# Altium schematic sheet mgmt.SchDoc
size A
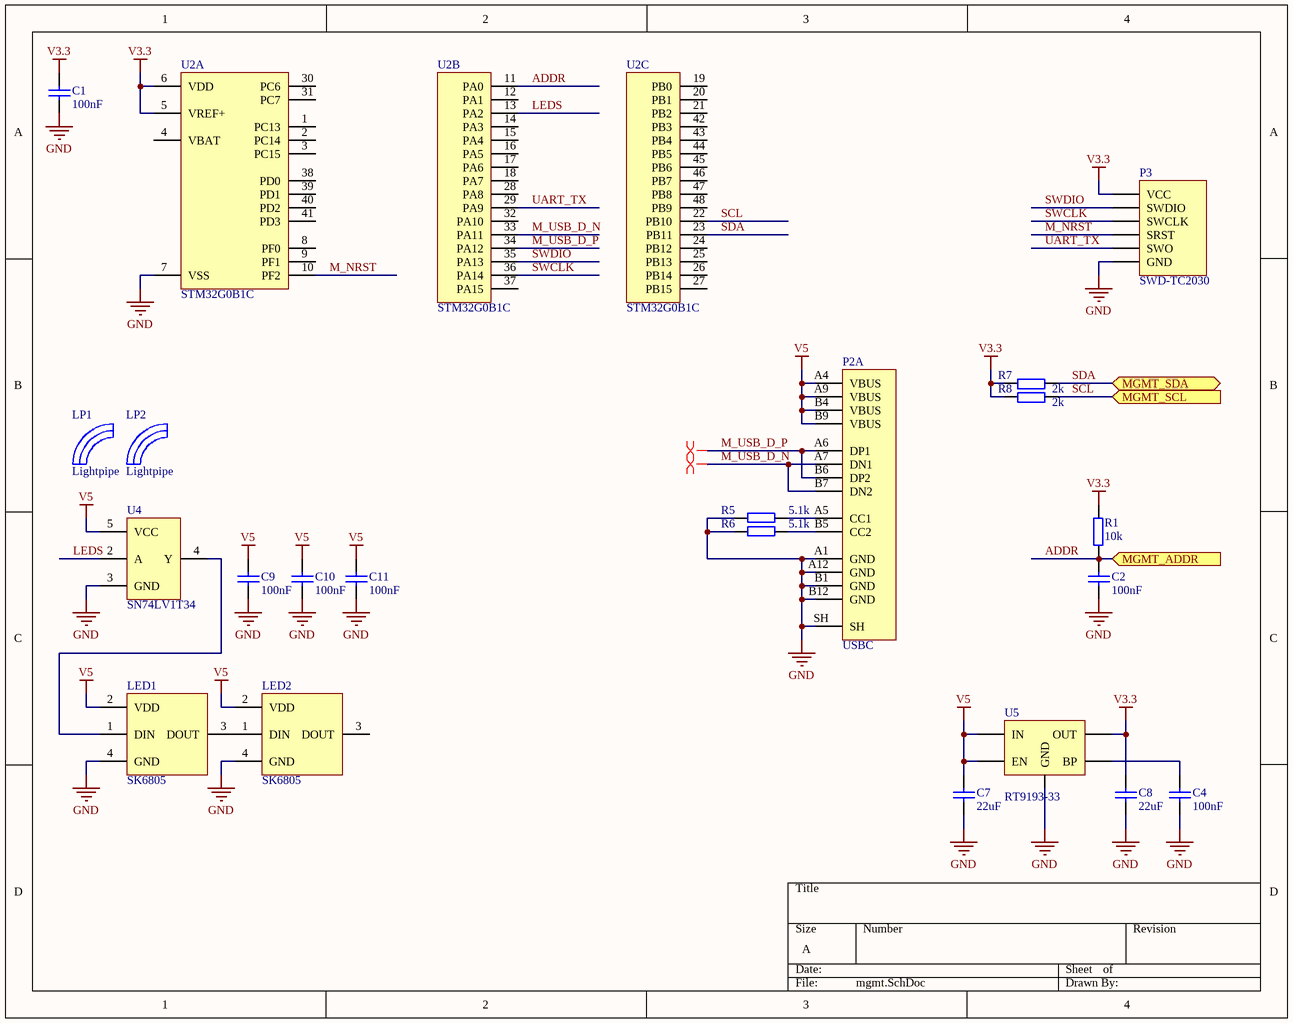
[diagram p0: mgmt.SchDoc]

## Parts
C1  100nF  [0402]
C2  100nF  [0402]
C4  100nF  [0402]
C7  22uF  [0805]
C8  22uF  [0805]
C9  100nF  [0402]
C10  100nF  [0402]
C11  100nF  [0402]
LED1  SK6805  [EC15]
LED2  SK6805  [EC15]
LP1  Lightpipe  [SLP3-150-100-F]
LP2  Lightpipe  [SLP3-150-100-F]
P2  USBC  [U262-161N-4BVC11]  (part A of 2)
P3  SWD-TC2030  [TC2030-NL]
R1  10k  [0402]
R5  5.1k  [0402]
R6  5.1k  [0402]
R7  2k  [0402]
R8  2k  [0402]
U2  STM32G0B1C  [QFP48]  (parts A,B,C of 3)
U4  SN74LV1T34  [SOT23-5]
U5  RT9193-33  [SOT23-5]

## Ports
MGMT_ADDR (in), MGMT_SCL (in), MGMT_SDA (bidir)

## Nets
GND: C1.1 C2.1 C4.1 C7.1 C8.1 C9.1 C10.1 C11.1 LED1.4(GND) LED2.4(GND) P2.A1(GND) P2.A12(GND) P2.B1(GND) P2.B12(GND) P2.SH P3.GND R5.1 R6.1 U2.7(VSS) U4.3(GND) U5.GND
V3.3: C1.2 C8.2 P3.VCC R1.2 R7.2 R8.2 U2.5(VREF+) U2.6(VDD) U5.OUT
V5: C7.2 C9.2 C10.2 C11.2 LED1.2(VDD) LED2.2(VDD) P2.A4(VBUS) P2.A9(VBUS) P2.B4(VBUS) P2.B9(VBUS) U4.5(VCC) U5.EN U5.IN
ADDR: C2.2 R1.1 U2.11(PA0) ; port MGMT_ADDR
LEDS: U2.13(PA2) U4.2(A)
M_NRST: P3.SRST U2.10(PF2)
M_USB_D_N: P2.A7(DN1) P2.B7(DN2) U2.33(PA11)
M_USB_D_P: P2.A6(DP1) P2.B6(DP2) U2.34(PA12)
SCL: R8.1 U2.22(PB10) ; port MGMT_SCL
SDA: R7.1 U2.23(PB11) ; port MGMT_SDA
SWCLK: P3.SWCLK U2.36(PA14)
SWDIO: P3.SWDIO U2.35(PA13)
UART_TX: P3.SWO U2.29(PA9)
NetC4_2: C4.2 U5.BP
NetLED1_1: LED1.1(DIN) U4.4(Y)
NetLED1_3: LED1.3(DOUT) LED2.1(DIN)
NetP2_A5: P2.A5(CC1) R5.2
NetP2_B5: P2.B5(CC2) R6.2

Not connected (* = marked no-connect by the designer): LED2 3(DOUT); U2 1(PC13) 2(PC14) 3(PC15) 4(VBAT) 8(PF0) 9(PF1) 12(PA1) 14(PA3) 15(PA4) 16(PA5) 17(PA6) 18(PA7) 19(PB0) 20(PB1) 21(PB2) 24(PB12) 25(PB13) 26(PB14) 27(PB15) 28(PA8) 30(PC6) 31(PC7) 32(PA10) 37(PA15) 38(PD0) 39(PD1) 40(PD2) 41(PD3) 42(PB3) 43(PB4) 44(PB5) 45(PB6) 46(PB7) 47(PB8) 48(PB9)

## Layout directives
differential pair: M_USB_D_N, M_USB_D_P

## Library data of the parts
C1 C2 C4 C7-C11 = Capacitor
  C1 C2 C4 C9-C11: Value: 100nF
  C7 C8: Value: 22uF
P2 = USBC: pin to pad: A2>none A3>none A10>none A11>none B2>none B3>none B10>none B11>none
P3 = SWD-TC2030: pin to pad: GND>5 SRST>3 SWCLK>4 SWDIO>2 SWO>6 VCC>1
R1 R5-R8 = Resistor
  R1: Value: 10k
  R5 R6: Value: 5.1k
  R7 R8: Value: 2k
U4 = SN74LV1T34: Single Power Supply Single Buffer GATE CMOS Logic Level Shifter
U5 = VREG_EN_BP: pin to pad: BP>4 EN>3 GND>2 IN>1 OUT>5